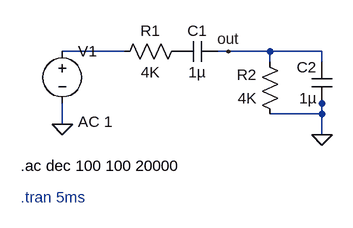
[diagram p0: schematic wienbridge1.asc]
wienbridge1.asc, the LTspice schematic file:
Version 4
SHEET 1 880 680
WIRE 96 128 0 128
WIRE 256 128 240 128
WIRE 320 128 256 128
WIRE 400 128 320 128
WIRE 320 144 320 128
WIRE 400 144 400 128
WIRE 400 208 400 192
WIRE 400 224 400 208
WIRE 400 224 320 224
WIRE 0 240 0 208
WIRE 400 256 400 224
FLAG 0 240 0
FLAG 400 256 0
FLAG 256 128 out
SYMBOL res 192 112 R90
WINDOW 0 0 56 VBottom 2
WINDOW 3 32 56 VTop 2
SYMATTR InstName R1
SYMATTR Value 4K
SYMBOL res 336 240 R180
WINDOW 0 36 76 Left 2
WINDOW 3 36 40 Left 2
SYMATTR InstName R2
SYMATTR Value 4K
SYMBOL cap 240 112 R90
WINDOW 0 0 32 VBottom 2
WINDOW 3 32 32 VTop 2
SYMATTR InstName C1
SYMATTR Value 1µ
SYMATTR SpiceLine V=1K Irms=5.2 Rser=0.0057 Lser=44.252n mfg="Würth Elektronik" pn="890494427003CS WCAP-FTDB 27.5x32x24.5x15x4" type="Box"
SYMBOL cap 416 208 R180
WINDOW 0 24 56 Left 2
WINDOW 3 24 8 Left 2
SYMATTR InstName C2
SYMATTR Value 1µ
SYMATTR SpiceLine V=1K Irms=5.2 Rser=0.0057 Lser=44.252n
SYMBOL voltage 0 112 R0
WINDOW 123 24 124 Left 2
WINDOW 39 0 0 Left 0
WINDOW 3 -307 104 Left 2
SYMATTR Value2 AC 1
SYMATTR Value ""
SYMATTR InstName V1
TEXT -64 352 Left 2 ;.tran 5ms
TEXT -64 304 Left 2 !.ac dec 100 100 20000

The netlist it stands for:
* wienbridge1.asc
R1 P001 N001 4K
R2 0 out 4K
C1 out P001 1µ V=1K Irms=5.2 Rser=0.0057 Lser=44.252n mfg="Würth Elektronik" pn="890494427003CS WCAP-FTDB 27.5x32x24.5x15x4" type="Box"
C2 0 out 1µ V=1K Irms=5.2 Rser=0.0057 Lser=44.252n
V1 N001 0 AC 1
* .tran 5ms
.ac dec 100 100 20000
.backanno
.end